# Altium schematic sheet motordriver-v5.0_current-sense.SchDoc
size A4; SheetNumber: 6; SheetTotal: 7
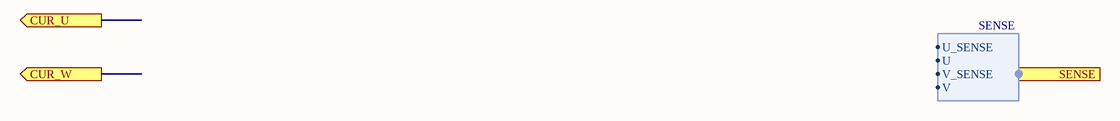
[diagram p0: motordriver-v5.0_current-sense.SchDoc]

## Ports
CUR_U (out), CUR_W (out), SENSE (harness SENSE)

## Harnesses
SENSE: U_SENSE, U, V_SENSE, V